# EAGLE schematic switch (EAGLE 7.4.0)
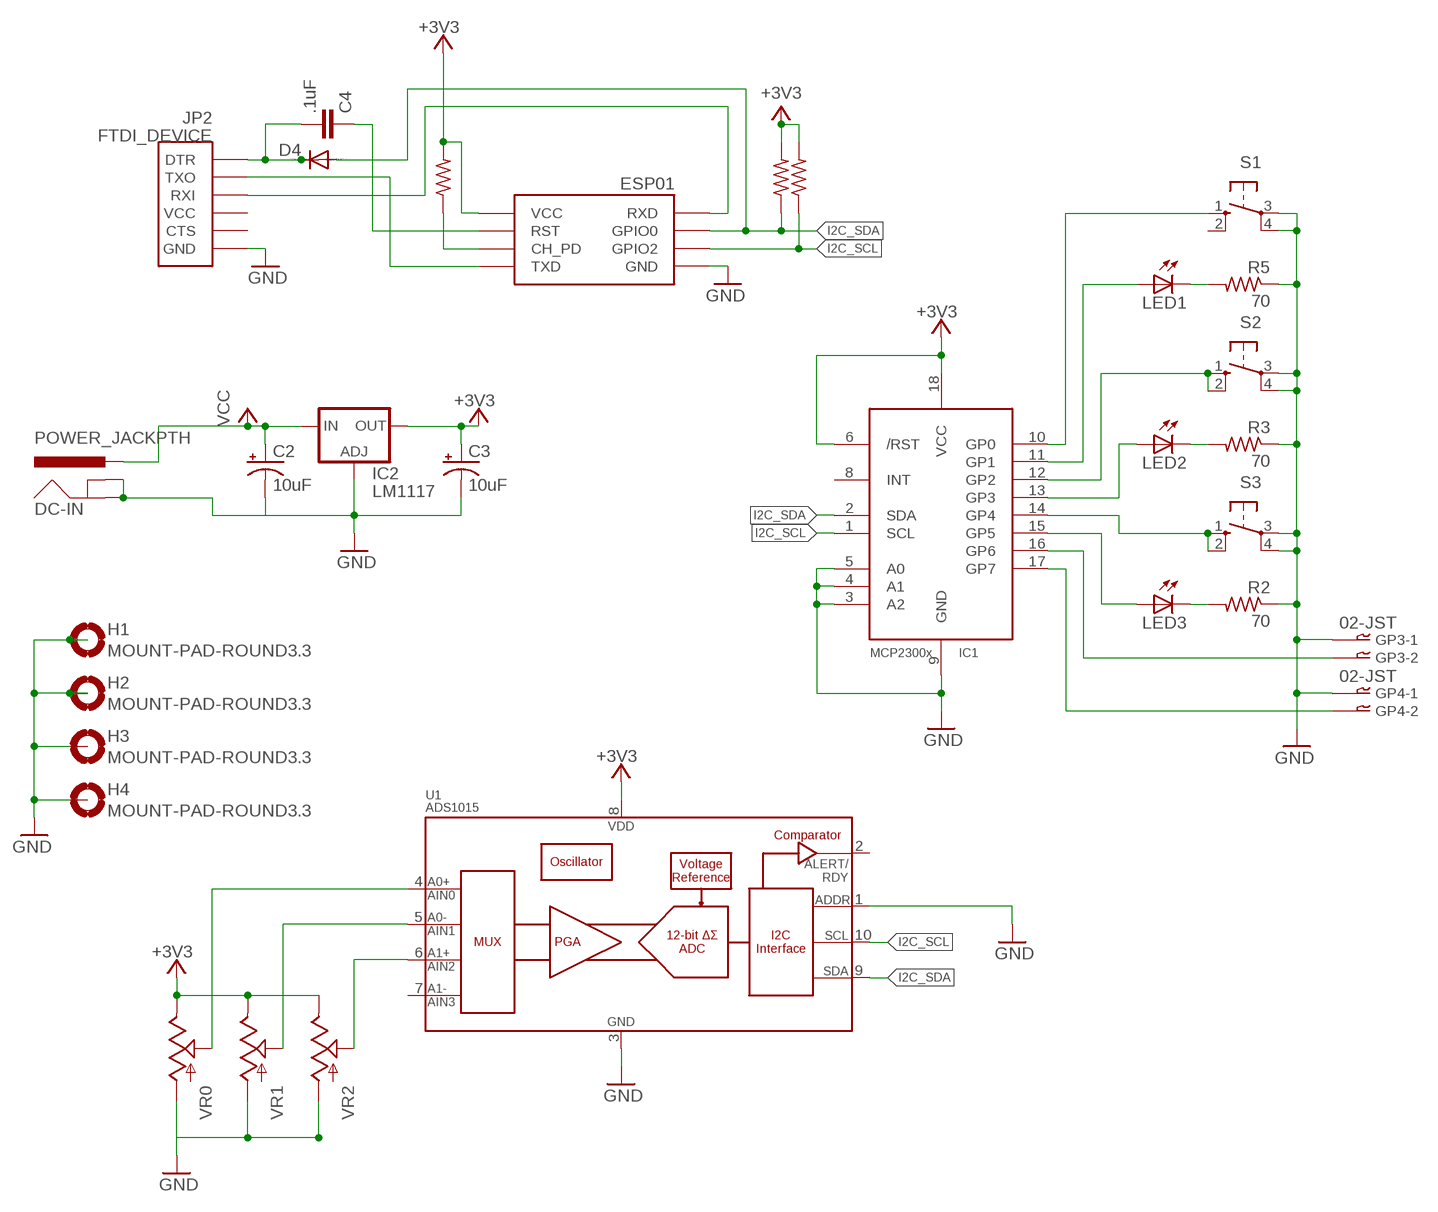
[diagram p0: schematic, sheet 1]

## Parts
C2  10uF  CPOL-US153CLV-0405  [153CLV-0405]
C3  10uF  CPOL-US153CLV-0405  [153CLV-0405]
C4  .1uF  CAP0603-CAP  [0603-CAP]
D4  DIODE-DO214AC  [DO214AC]
DC-IN  POWER_JACKPTH  [POWER_JACK_PTH]
ESP-01  ESP01  [ESP01]
GP3  02-JST  [B2B-XH]
GP4  02-JST  [B2B-XH]
H1  MOUNT-PAD-ROUND3.3  [3,3-PAD]
H2  MOUNT-PAD-ROUND3.3  [3,3-PAD]
H3  MOUNT-PAD-ROUND3.3  [3,3-PAD]
H4  MOUNT-PAD-ROUND3.3  [3,3-PAD]
IC1  MCP2300X/SO  [SO18W]
IC2  LM1117  LD117ADT-TR  [DPACK]
JP2  FTDI_DEVICE  [FTDI_DEVICE_SIDE]
LED1  LED3MM  [LED3MM]
LED2  LED3MM  [LED3MM]
LED3  LED3MM  [LED3MM]
R2  70  R-US_R0603  [R0603]
R3  70  R-US_R0603  [R0603]
R4  10k  R-US_R0603  [R0603]
R5  70  R-US_R0603  [R0603]
R7  10k  R-US_R0603  [R0603]
R8  10k  R-US_R0603  [R0603]
S1  10-XX  [B3F-10XX]
S2  10-XX  [B3F-10XX]
S3  10-XX  [B3F-10XX]
U1  ADS1015  [MSOP10]
VR0  SLIDERPTA3043  [PTA3043-2015CPB103]
VR1  SLIDERPTA3043  [PTA3043-2015CPB103]
VR2  SLIDERPTA3043  [PTA3043-2015CPB103]

## Nets
+3V3: C3.+ ESP-01.VCC IC1.6(/RST) IC1.18(VCC) IC2.4(OUT) R4.2 R7.2 R8.2 U1.8(VDD) VR0.P$3(E) VR1.P$3(E) VR2.P$3(E)
GND: C2.- C3.- ESP-01.GND GP3.P$1 GP4.P$1 H1.B3,3(MOUNT) H2.B3,3(MOUNT) H3.B3,3(MOUNT) H4.B3,3(MOUNT) IC1.3(A2) IC1.4(A1) IC1.5(A0) IC1.9(GND) IC2.1(ADJ) JP2.P$6(GND) R2.1 R3.1 R5.1 S1.3(P) S1.4(P1) S2.3(P) S2.4(P1) S3.3(P) S3.4(P1) U1.1(ADDR) U1.3(VSS) VR0.P$1(A) VR1.P$1(A) VR2.P$1(A)
GP0: IC1.10(GP0) S1.1(S)
GP1: IC1.11(GP1) LED1.A
GP2: IC1.12(GP2) S2.1(S) S2.2(S1)
GP3: IC1.13(GP3) LED2.A
GP4: IC1.14(GP4) S3.1(S) S3.2(S1)
GP5: IC1.15(GP5) LED3.A
GP6: GP3.P$2 IC1.16(GP6)
GP7: GP4.P$2 IC1.17(GP7)
I2C_SCL: ESP-01.GPIO2 IC1.1(SCL) R8.1 U1.10(SCL)
I2C_SDA: D4.A ESP-01.GPIO0 IC1.2(SDA) R7.1 U1.9(SDA)
N$1: ESP-01.CH_PD R4.1
N$2: C4.2 D4.C JP2.P$1(DTR)
N$3: U1.6(AIN2) VR2.P$2(S)
N$4: U1.5(AIN1) VR1.P$2(S)
N$5: U1.4(AIN0) VR0.P$2(S)
N$6: LED1.K(C) R5.2
N$7: LED2.K(C) R3.2
N$8: LED3.K(C) R2.2
N$9: DC-IN.GND DC-IN.GNDBREAK
RST: C4.1 ESP-01.RST
RXI: ESP-01.RX(RXD) JP2.P$3(RXI)
TXO: ESP-01.TX(TXD) JP2.P$2(TXO)
VCC: C2.+ DC-IN.PWR IC2.3(IN)
Unconnected: IC1.8(INT) JP2.P$4(VCC) JP2.P$5(CTS) S1.2(S1) U1.2(ALERT/RDY) U1.7(AIN3)

## Library data of the parts
C2 C3 = rcl:CPOL-US: POLARIZED CAPACITOR, American symbol
C4 = SparkFun-Passives:CAP: Capacitor Standard 0603 ceramic capacitor, and 0.1" leaded capacitor.
D4 = diode:DIODE-: DIODE
DC-IN = SparkFun-Connectors:POWER_JACK: Power Jack This is the standard 5.5mm barrel jack for power. The PTH is the most common, proven, reliable, footprint. The Slot footprint only works if the mill layer is transmitted to the PCB fab house so be warned. Mating wall wart : TOL-00298 (and others); PROD_ID: CONN-08197
ESP-01 = esp8266modules-pk:ESP01: ESP8266 Wifi module 01
GP3 GP4 = con-jst-xh:02-JST: JST CONNECTOR
H1-H4 = holes:MOUNT-PAD-ROUND: MOUNTING PAD, round
IC1 = adafruit:MCP2300X: MCP23008 Inexpensive i2c i/o expander - 8 general purpose i/o pins with optional pullups
IC2 = v-reg:LD117A?*: Low drop fixed and adjustable positive voltage regulators 1 A Source: http://www.st.com/stonline/products/literature/ds/7194/ld1117axx.pdf
JP2 = SparkFun-Connectors:FTDI_DEVICE: Connector which mates to FTDI basic or FTDI cable.
LED1-LED3 = adafruit:LED: LED OSRAM: - CHIPLED LG R971, LG N971, LY N971, LG Q971, LY Q971, LO R971, LY R971 LH N974, LH R974 LS Q976, LO Q976, LY Q976 LO Q996 - Hyper CHIPLED LW Q18S LB Q993, LB Q99A, LB R99A - SideLED LS A670, LO A670, LY A670, LG A670, LP A670 LB A673, LV A673, LT A673, LW A673 LH A674 LY A675 LS A676, LA A676, LO A676, LY A676, LW A676 LS A679, LY A679, LG A679 - Hyper Micro SIDELED® LS Y876, LA Y876, LO Y876, LY Y876 LT Y87S - SmartLED LW L88C, LW L88S LB L89C, LB L89S, LG L890 LS L89K, LO L89K, LY L89K LS L896, LA L896, LO L896, LY L896 - TOPLED LS T670, LO T670, LY T670, LG T670, LP T670 LSG T670, LSP T670, LSY T670, LOP T670, LYG T670 LG T671, LOG T671, LSG T671 LB T673, LV T673, LT T673, LW T673 LH T674 LS T676, LA T676, LO T676, LY T676, LB T676, LH T676, LSB T676, LW T676 LB T67C, LV T67C, LT T67C, LS T67K, LO T67K, LY T67K, LW E67C LS E67B, LA E67B, LO E67B, LY E67B, LB E67C, LV E67C, LT E67C LW T67C LS T679, LY T679, LG T679 LS T770, LO T770, LY T770, LG T770, LP T770 LB T773, LV T773, LT T773, LW T773 LH T774 LS E675, LA E675, LY E675, LS T675 LS T776, LA T776, LO T776, LY T776, LB T776 LHGB T686 LT T68C, LB T68C - Hyper Mini TOPLED® LB M676 - Mini TOPLED Santana® LG M470 LS M47K, LO M47K, LY M47K Source: http://www.osram.convergy.de/
R2-R5 R7 R8 = resistor:R-US_: RESISTOR, American symbol
S1-S3 = switch-omron:10-XX: OMRON SWITCH; MPN: B3F-1000; OC_FARNELL: 176432; OC_NEWARK: 36M3542
U1 = SparkFun-AnalogIC:ADS1015: 12-Bit Del-Sig ADC Four single-ended inputs or two differential inputs Internal PGA I2C interface 2.0-5.5V; PROD_ID: IC-12239
VR0 VR1 VR2 = SparkFun-Electromechanical:SLIDER: Slide-type potentiometers. Small and meduim footprints untested.

## Net classes
1 ext: width 1.93 mm, clearance 1 mm
2 5v: width 0.61 mm